# EAGLE design PCBMotores (EAGLE 7.6.0)
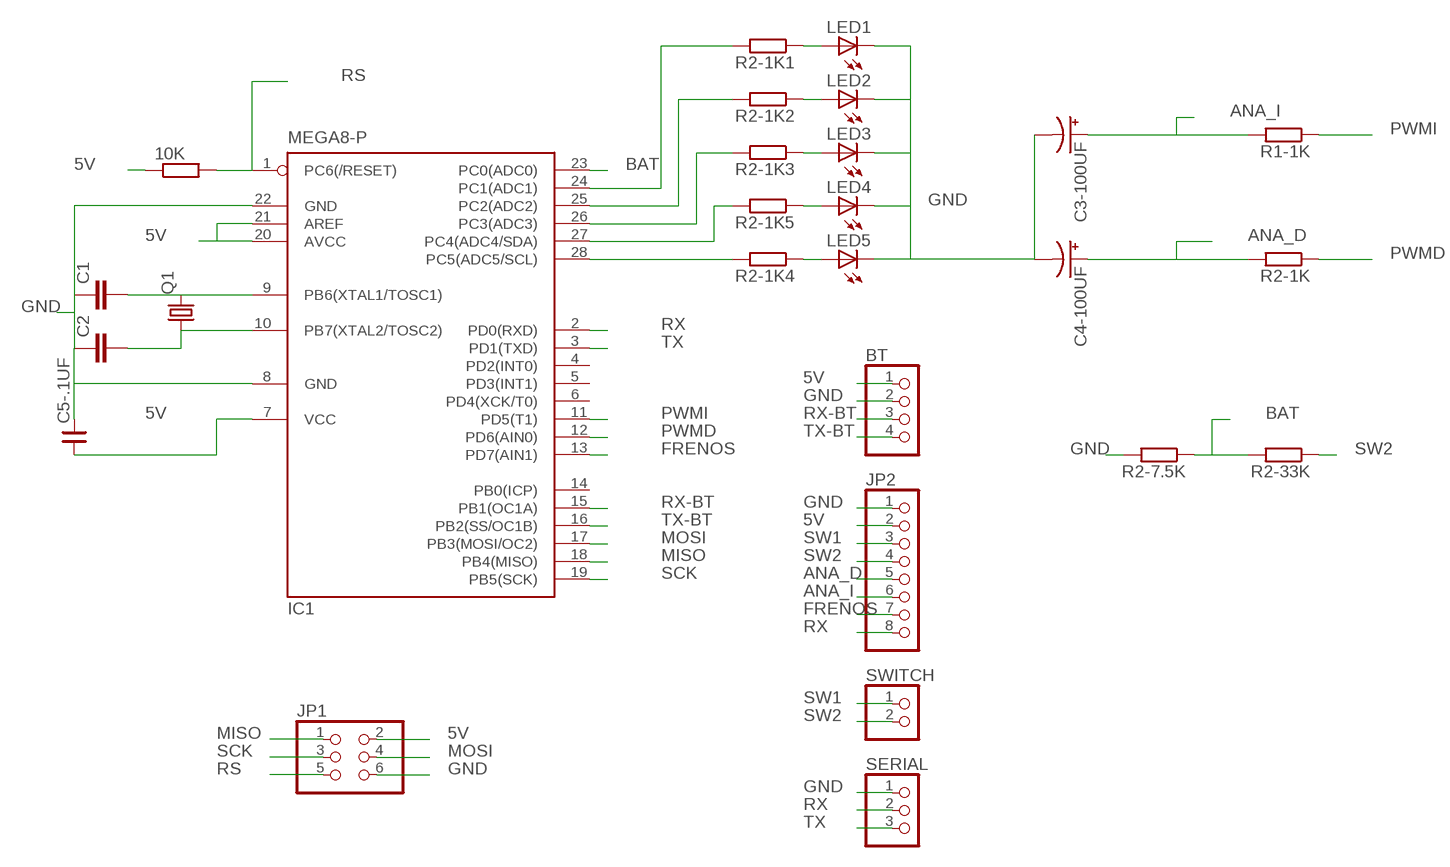
[diagram p0: schematic, sheet 1]

## Parts
10K  R-EU_0204/7  [0204/7]
BT  PINHD-1X4  [1X04]
C1  C2.5/5  [C2.5-5]
C2  C2.5/5  [C2.5-5]
C3-100UF  CPOL-USE2-4  [E2-4]
C4-100UF  CPOL-USE2-4  [E2-4]
C5-.1UF  CNP-C035-055X025  [C035-055X025]
IC1  MEGA8-P  [DIL28-3]
JP1  PINHD-2X3  [2X03]
JP2  PINHD-1X8  [1X08]
LED1  LED5MM  [LED5MM]
LED2  LED5MM  [LED5MM]
LED3  LED5MM  [LED5MM]
LED4  LED5MM  [LED5MM]
LED5  LED5MM  [LED5MM]
Q1  CRYSTALHC49S  [HC49/S]
R1-1K  R-EU_0207/10  [0207/10]
R2-1K  R-EU_0207/10  [0207/10]
R2-1K1  R-EU_0207/10  [0207/10]
R2-1K2  R-EU_0207/10  [0207/10]
R2-1K3  R-EU_0207/10  [0207/10]
R2-1K4  R-EU_0207/10  [0207/10]
R2-1K5  R-EU_0207/10  [0207/10]
R2-7.5K  R-EU_0207/10  [0207/10]
R2-33K  R-EU_0207/10  [0207/10]
SERIAL  PINHD-1X3  [1X03]
SWITCH  PINHD-1X2  [1X02]

## Nets
5V: 10K.1 BT.1 C5-.1UF.1 IC1.7(VCC) IC1.20(AVCC) IC1.21(AREF) JP1.2 JP2.2
ANA_D: C4-100UF.+ JP2.5 R2-1K.2
ANA_I: C3-100UF.+ JP2.6 R1-1K.2
BAT: IC1.23(PC0(ADC0)) R2-7.5K.1 R2-33K.2
FRENOS: IC1.13(PD7(AIN1)) JP2.7
GND: BT.2 C1.1 C2.1 C3-100UF.- C4-100UF.- C5-.1UF.2 IC1.8(GND) IC1.22(GND) JP1.6 JP2.1 LED1.K(C) LED2.K(C) LED3.K(C) LED4.K(C) LED5.K(C) R2-7.5K.2 SERIAL.1
MISO: IC1.18(PB4(MISO)) JP1.1
MOSI: IC1.17(PB3(MOSI/OC2)) JP1.4
N$3: IC1.28(PC5(ADC5/SCL)) R2-1K4.2
N$4: IC1.27(PC4(ADC4/SDA)) R2-1K5.2
N$5: IC1.26(PC3(ADC3)) R2-1K3.2
N$6: C2.2 IC1.10(PB7(XTAL2/TOSC2)) Q1.1
N$7: C1.2 IC1.9(PB6(XTAL1/TOSC1)) Q1.2
N$8: IC1.25(PC2(ADC2)) R2-1K2.2
N$9: IC1.24(PC1(ADC1)) R2-1K1.2
N$10: LED1.A R2-1K1.1
N$11: LED2.A R2-1K2.1
N$12: LED3.A R2-1K3.1
N$13: LED4.A R2-1K5.1
N$14: LED5.A R2-1K4.1
PWMD: IC1.12(PD6(AIN0)) R2-1K.1
PWMI: IC1.11(PD5(T1)) R1-1K.1
RS: 10K.2 IC1.1(PC6(/RESET)) JP1.5
RX: IC1.2(PD0(RXD)) JP2.8 SERIAL.2
RX-BT: BT.3 IC1.15(PB1(OC1A))
SCK: IC1.19(PB5(SCK)) JP1.3
SW1: JP2.3 SWITCH.1
SW2: JP2.4 R2-33K.1 SWITCH.2
TX: IC1.3(PD1(TXD)) SERIAL.3
TX-BT: BT.4 IC1.16(PB2(SS/OC1B))
Unconnected: IC1.4(PD2(INT0)) IC1.5(PD3(INT1)) IC1.6(PD4(XCK/T0)) IC1.14(PB0(ICP))

## Library data of the parts
10K R1-1K R2-1K R2-1K1-R2-1K5 R2-7.5K R2-33K = rcl:R-EU_: RESISTOR, European symbol
BT = pinhead:PINHD-1X4: PIN HEADER
C1 C2 = capacitor-wima:C: CAPACITOR naming: grid - package width
C3-100UF C4-100UF = rcl:CPOL-US: POLARIZED CAPACITOR, American symbol
C5-.1UF = cap-master:CNP-: NON-POLARIZED CAP
IC1 = atmel:MEGA8-P: MICROCONTROLLER 8 Kbytes FLASH, 1 kbytes SRAM, 512 bytes EEPROM, USART, 4-channel 10 bit ADC, 2-channel 8 bit ADC Pin compatible with Atmega48, ATMega88, ATMega168 Source: avr.lbr; OC_FARNELL: unknown; OC_NEWARK: unknown
JP1 = pinhead:PINHD-2X3: PIN HEADER
JP2 = pinhead:PINHD-1X8: PIN HEADER
LED1-LED5 = led:LED: LED OSRAM: - CHIPLED LG R971, LG N971, LY N971, LG Q971, LY Q971, LO R971, LY R971 LH N974, LH R974 LS Q976, LO Q976, LY Q976 LO Q996 - Hyper CHIPLED LW Q18S LB Q993, LB Q99A, LB R99A - SideLED LS A670, LO A670, LY A670, LG A670, LP A670 LB A673, LV A673, LT A673, LW A673 LH A674 LY A675 LS A676, LA A676, LO A676, LY A676, LW A676 LS A679, LY A679, LG A679 - Hyper Micro SIDELED® LS Y876, LA Y876, LO Y876, LY Y876 LT Y87S - SmartLED LW L88C, LW L88S LB L89C, LB L89S, LG L890 LS L89K, LO L89K, LY L89K LS L896, LA L896, LO L896, LY L896 - TOPLED LS T670, LO T670, LY T670, LG T670, LP T670 LSG T670, LSP T670, LSY T670, LOP T670, LYG T670 LG T671, LOG T671, LSG T671 LB T673, LV T673, LT T673, LW T673 LH T674 LS T676, LA T676, LO T676, LY T676, LB T676, LH T676, LSB T676, LW T676 LB T67C, LV T67C, LT T67C, LS T67K, LO T67K, LY T67K, LW E67C LS E67B, LA E67B, LO E67B, LY E67B, LB E67C, LV E67C, LT E67C LW T67C LS T679, LY T679, LG T679 LS T770, LO T770, LY T770, LG T770, LP T770 LB T773, LV T773, LT T773, LW T773 LH T774 LS E675, LA E675, LY E675, LS T675 LS T776, LA T776, LO T776, LY T776, LB T776 LHGB T686 LT T68C, LB T68C - Hyper Mini TOPLED® LB M676 - Mini TOPLED Santana® LG M470 LS M47K, LO M47K, LY M47K Source: http://www.osram.convergy.de LUXEON: - LUMILED® LXK2-PW12-R00, LXK2-PW12-S00, LXK2-PW14-U00, LXK2-PW14-V00 LXK2-PM12-R00, LXK2-PM12-S00, LXK2-PM14-U00 LXK2-PE12-Q00, LXK2-PE12-R00, LXK2-PE12-S00, LXK2-PE14-T00, LXK2-PE14-U00 LXK2-PB12-K00, LXK2-PB12-L00, LXK2-PB12-M00, LXK2-PB14-N00, LXK2-PB14-P00, LXK2-PB14-Q00 LXK2-PR12-L00, LXK2-PR12-M00, LXK2-PR14-Q00, LXK2-PR14-R00 LXK2-PD12-Q00, LXK2-PD12-R00, LXK2-PD12-S00 LXK2-PH12-R00, LXK2-PH12-S00 LXK2-PL12-P00, LXK2-PL12-Q00, LXK2-PL12-R00 Source: www.luxeon.com KINGBRIGHT: KA-3528ASYC Source: www.kingbright.com
Q1 = crystal:CRYSTAL: CRYSTAL; OC_FARNELL: 1667008; OC_NEWARK: unknown
SERIAL = pinhead:PINHD-1X3: PIN HEADER
SWITCH = pinhead:PINHD-1X2: PIN HEADER

## Board
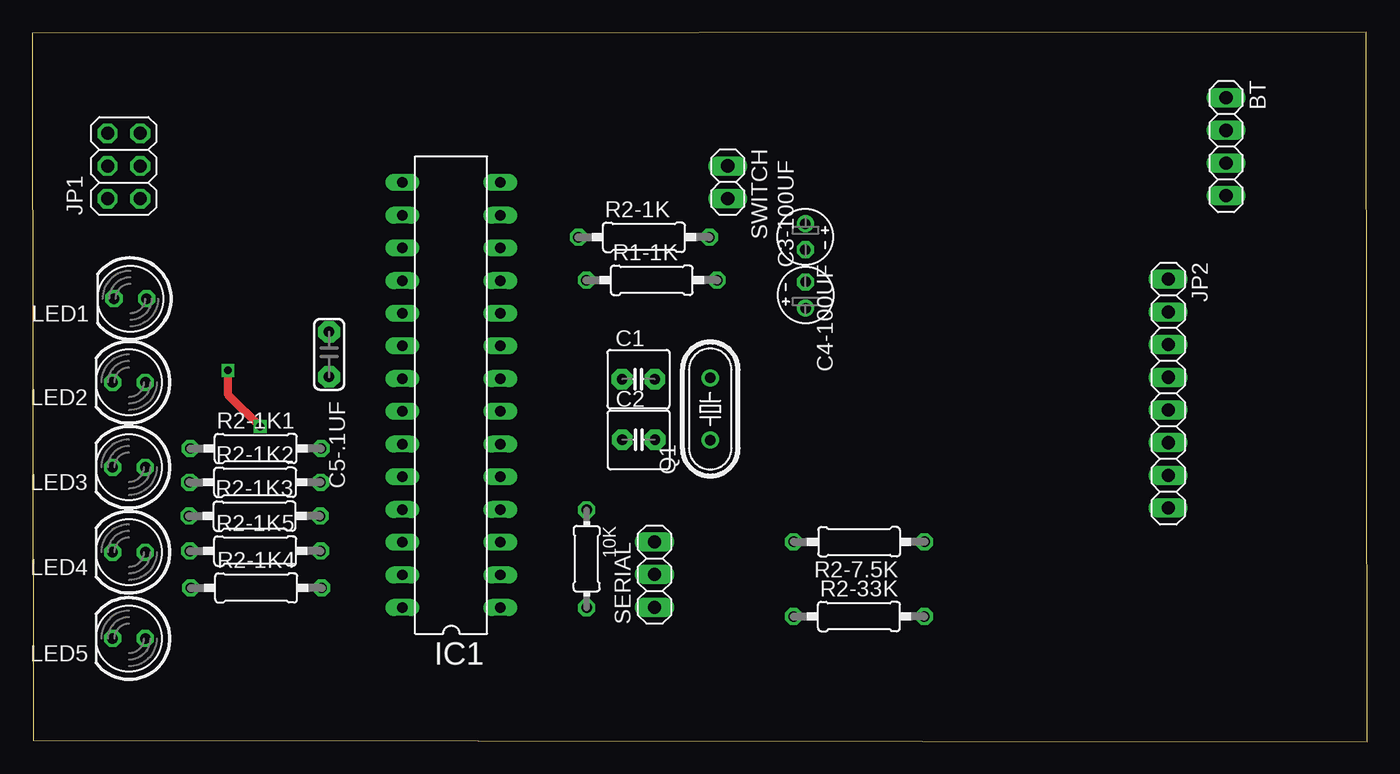
[diagram p1: board, top side]
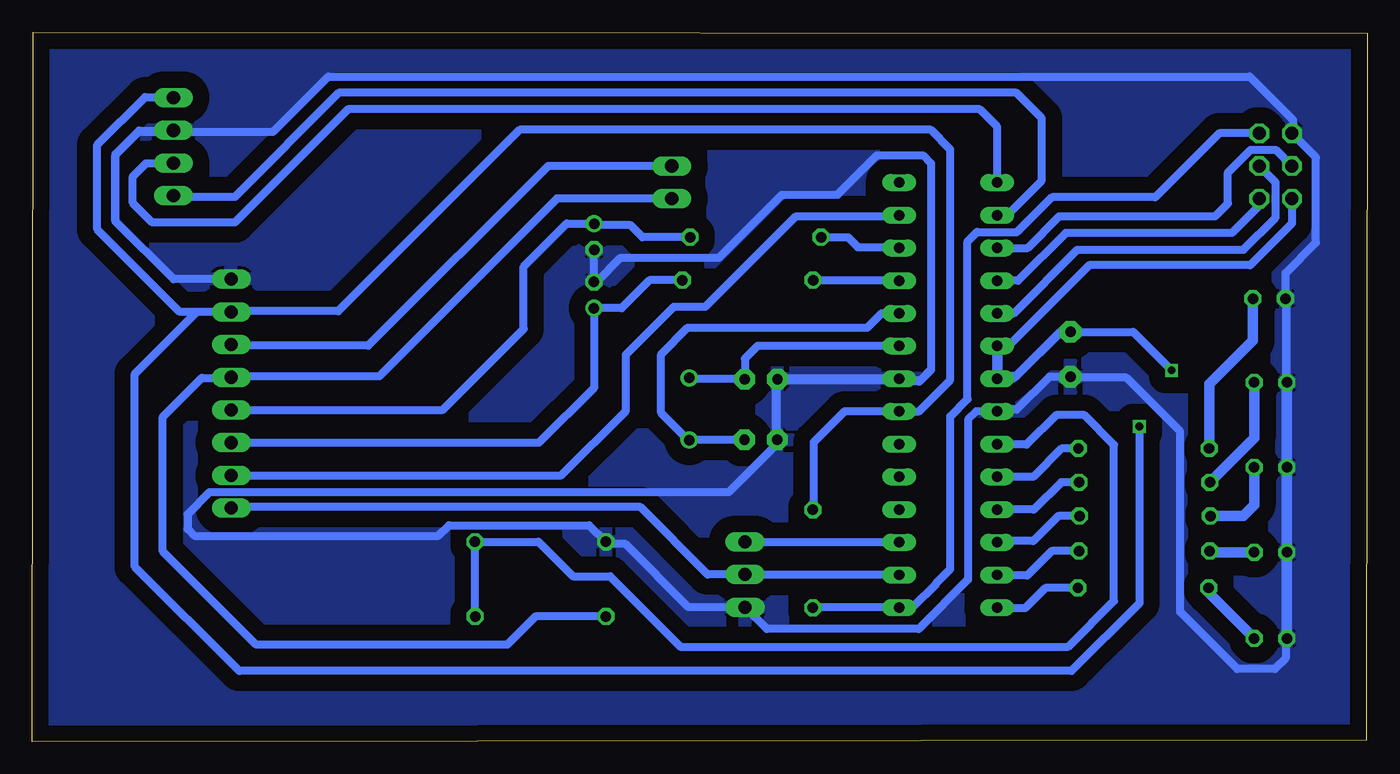
[diagram p2: board, bottom side, seen from below]

Size 103.69 x 55.11 mm. Coordinates in mm from the lower left corner, seen from the top.
Outline: 0.08,0.1 103.69,0 103.61,55.11 0,55.01 0.08,0.1
Copper layers (1*16): Top 0.035mm / dielectric 1.5mm / Bottom 0.035mm
Design rules "default": minimum track width 10mil, minimum drill 24mil, track to track 8mil, track to pad 8mil, pad to pad 8mil, via to via 8mil, smd to smd 8mil, copper to edge 40mil, drill to drill 8mil, minimum pad ring 10mil, minimum via ring 8mil, stop-mask expansion 4mil, vias tented up to drill 0mil, thermal gap 10mil

### Footprints (pad centres in the part's own frame; a part is rotated, then mirrored left to right if it is on the bottom)
0204/7 = drill 0.813 octagon: 1 -3.81,0; 2 3.81,0
1X04 = drill 1.016 long: 1 -3.81,0; 2 -1.27,0; 3 1.27,0; 4 3.81,0
C2.5-5 = drill 0.813 pad 1.6 octagon: 1 -1.27,0; 2 1.27,0
E2-4 = drill 0.813 pad 1.27: + -1.016,0 | drill 0.813 pad 1.27 octagon: - 1.016,0
C035-055X025 = drill 0.813 pad 1.676 octagon: 1 -1.587,0; 2 1.905,0
DIL28-3 = drill 0.813 long: 1 -16.51,-3.81; 2 -13.97,-3.81; 3 -11.43,-3.81; 4 -8.89,-3.81; 5 -6.35,-3.81; 6 -3.81,-3.81; 7 -1.27,-3.81; 8 1.27,-3.81; 9 3.81,-3.81; 10 6.35,-3.81; 11 8.89,-3.81; 12 11.43,-3.81; 13 13.97,-3.81; 14 16.51,-3.81; 15 16.51,3.81; 16 13.97,3.81; 17 11.43,3.81; 18 8.89,3.81; 19 6.35,3.81; 20 3.81,3.81; 21 1.27,3.81; 22 -1.27,3.81; 23 -3.81,3.81; 24 -6.35,3.81; 25 -8.89,3.81; 26 -11.43,3.81; 27 -13.97,3.81; 28 -16.51,3.81
2X03 = drill 1.016 octagon: 1 -2.54,-1.27; 2 -2.54,1.27; 3 0,-1.27; 4 0,1.27; 5 2.54,-1.27; 6 2.54,1.27
1X08 = drill 1.016 long: 1 -8.89,0; 2 -6.35,0; 3 -3.81,0; 4 -1.27,0; 5 1.27,0; 6 3.81,0; 7 6.35,0; 8 8.89,0
LED5MM = drill 0.813 octagon: A -1.27,0; K 1.27,0
HC49/S = drill 0.813: 1 -2.413,0; 2 2.413,0
0207/10 = drill 0.813 octagon: 1 -5.08,0; 2 5.08,0
1X03 = drill 1.016 long: 1 -2.54,0; 2 0,0; 3 2.54,0
1X02 = drill 1.016 long: 1 -1.27,0; 2 1.27,0

### Placement (x,y rotation side)
10K  43.06,14.2 270 top
BT  92.72,46.21 270 top
C1  47.08,28.15 0 top
C2  47.1,23.44 0 top
C3-100UF  60.06,34.69 90 top
C4-100UF  60.05,39.22 270 top
C5-.1UF  23.06,30.24 270 top
IC1  32.55,26.92 90 top
JP1  7.12,44.71 90 top
JP2  88.23,27.03 270 top
LED1  7.62,34.41 180 top
LED2  7.52,27.91 180 top
LED3  7.52,21.31 180 top
LED4  7.52,14.71 180 top
LED5  7.52,8.01 180 top
Q1  52.66,25.84 90 top
R1-1K  48.12,35.84 0 top
R2-1K  47.51,39.18 0 top
R2-1K1  17.36,22.77 0 top
R2-1K2  17.31,20.15 0 top
R2-1K3  17.27,17.52 0 top
R2-1K4  17.4,11.94 0 top
R2-1K5  17.32,14.81 0 top
R2-7.5K  64.22,15.52 180 top
R2-33K  64.21,9.72 0 top
SERIAL  48.33,12.98 90 top
SWITCH  54.02,43.45 270 top

### Tracks (layer width: path | path; a pad name or v marks a point on that pad's centre or on a via)
5V  (via drill 0.6)
  Top 0.61: v15.2,28.84 15.2,26.98 v17.7,24.48
  Bottom 0.61: JP1.2 5.85,40.25 9.09,37.01 21.59,37.01 27.88,30.72 IC1.20 | C5-.1UF.1 23.81,31.83 27.25,28.39 28.54,28.39 IC1.21 27.49,28.19 23.86,31.82 18.18,31.82 v15.2,28.84 | 10K.1 43,18.07 43,23.24 40.59,25.65 IC1.7 34.82,25.65 32.38,28.09 32.38,46 33.91,47.53 65.82,47.53 79.92,33.43 88.18,33.43 JP2.2 90.91,33.38 | 90.91,33.38 92.23,33.38 98.63,39.78 98.63,46.36 94.92,50.07 92.77,50.07 BT.1 | v17.7,24.48 17.7,10.75 22.97,5.48 87.61,5.48 95.72,13.59 95.72,28.57 90.91,33.38
  Bottom 0.813: IC1.20 IC1.21
ANA_D
  Bottom 0.61: JP2.5 71.81,25.76 65.52,32.05 65.52,36.9 62.18,40.24 60.6,40.24 | 60.6,40.24 C4-100UF.+ | R2-1K.2 56.29,39.18 57.22,40.11 60.47,40.11 60.6,40.24
ANA_I
  Bottom 0.61: R1-1K.2 55.73,35.84 57.91,33.66 60.05,33.66 C3-100UF.+ 60.03,33.64 60.03,27.52 64.33,23.22 JP2.6
BAT
  Bottom 0.61: R2-33K.2 R2-7.5K.1 64.38,15.52 61.7,12.84 58.81,12.84 53.34,7.37 23.23,7.37 19.67,10.93 19.67,23.06 21.98,25.37 24.16,25.37 26.46,23.07 28.7,23.07 IC1.23
FRENOS
  Bottom 0.61: JP2.7 62.61,20.68 57.59,25.7 57.59,30.05 53.86,33.78 51.4,33.78 44.36,40.82 36.43,40.82 IC1.13
GND
  Bottom 0.61: LED2.K 6.25,34.31 LED1.K | C5-.1UF.2 24.69,28.34 27.25,25.78 28.61,25.78 IC1.22 30.37,25.65 31,25.02 31,12.59 34.84,8.75 46.64,8.75 SERIAL.1 52.71,10.44 57.62,15.35 58.97,15.35 R2-7.5K.2 60.43,16.81 71.33,16.81 72.15,15.99 91.1,15.99 91.63,16.52 91.63,17.66 89.93,19.36 49.6,19.36 45.96,23 45.96,28.2 45.8,28.04 34.72,28.04 33.88,28.88 33.88,28.89 | C5-.1UF.2 23.06,28.42 | C2.1 45.83,28.13 C1.1 45.77,28.19 IC1.8 36.14,27.97 34.8,27.97 33.88,28.89 | C4-100UF.- C3-100UF.- 59.87,35.71 57.99,37.59 50.36,37.59 45.46,42.49 41.15,42.49 38.09,45.55 34.52,45.55 33.88,44.91 33.88,28.89 | BT.2 92.74,47.46 95.39,47.46 97.21,45.64 97.21,40.41 92.72,35.92 JP2.1 92.71,35.92 97.24,40.45 97.24,45.54 95.4,47.38 84.98,47.38 80.7,51.66 9.14,51.66 5.78,48.3 5.78,47.32 JP1.6 4,45.4 4,38.75 6.35,36.4 LED1.K | LED1.K 6.35,6.47 7.18,5.64 10.1,5.64 14.53,10.07 14.53,24.08 18.72,28.27 22.99,28.27 C5-.1UF.2
  Bottom 0.813: LED5.K LED4.K LED3.K LED2.K
  pour Bottom (isolate 1.27): 102.31,53.71 102.52,1.28 1.51,1.28 1.3,53.71
MISO
  Bottom 0.61: JP1.1 8.39,41.64 10.52,39.51 23.42,39.51 27.12,35.81 IC1.18
MOSI
  Bottom 0.61: IC1.17 26.38,38.35 23.92,40.81 11.82,40.81 10.82,41.81 10.82,44.21 9.08,45.95 9.06,45.95 9.03,45.98 7.12,45.98 JP1.4
N$3
  Bottom 0.61: R2-1K4.2 25,11.94 26.58,10.36 28.69,10.36 IC1.28
N$4
  Bottom 0.61: R2-1K5.2 24.51,14.81 26.41,12.91 28.7,12.91 IC1.27
N$5
  Bottom 0.61: R2-1K3.2 24.01,17.52 25.95,15.58 28.65,15.58 IC1.26
N$6
  Bottom 0.61: C2.2 52.65,23.44 Q1.1 52.75,23.43 54.85,25.53 54.85,30.08 52.78,32.15 38.84,32.15 37.7,33.29 36.38,33.29 IC1.10
N$7
  Bottom 0.61: IC1.9 47.35,30.73 48.34,29.74 C1.2 52.56,28.15 Q1.2
N$8
  Bottom 0.61: R2-1K2.2 23.77,20.15 25.9,18.02 IC1.25
N$9
  Bottom 0.61: R2-1K1.2 23.75,22.77 25.95,20.57 IC1.24
N$10
  Bottom 0.813: LED1.A 8.89,31.15 12.26,27.78 12.26,22.79 R2-1K1.1
N$11
  Bottom 0.813: LED2.A 8.79,23.59 R2-1K2.1
N$12
  Bottom 0.813: LED3.A 8.79,18.38 9.63,17.54 12.17,17.54 R2-1K3.1
N$13
  Bottom 0.813: LED4.A 12.14,14.71 R2-1K5.1
N$14
  Bottom 0.813: R2-1K4.1 12.32,11.54 LED5.A
PWMD
  Bottom 0.61: R2-1K.1 40.33,39.18 39.56,38.41 36.42,38.41 IC1.12
PWMI
  Bottom 0.61: IC1.11 43.01,35.81 R1-1K.1
RS
  Bottom 0.61: 10K.2 43.04,10.41 IC1.1 35.33,10.41 33.47,12.27 33.47,12.32 32.38,13.41 32.38,25.27 31.05,26.6 31.05,38.86 30.32,39.59 27.19,39.59 27.06,39.72 27.05,39.72 24.48,42.29 16.47,42.29 11.51,47.25 JP1.5
RX
  Bottom 0.61: IC1.2 48.3,12.95 SERIAL.2 51.23,12.98 56.46,18.21 88.16,18.21 JP2.8
RX-BT
  Bottom 0.61: IC1.15 28.74,47.76 30.1,49.12 79.17,49.12 87.96,40.33 94.36,40.33 95.87,41.84 95.87,43.89 94.84,44.92 92.74,44.92 BT.3
SCK
  Bottom 0.61: IC1.19 27.46,33.27 22.52,38.21 9.62,38.21 7.12,40.71 7.12,43.44 JP1.3
SW1
  Bottom 0.61: SWITCH.1 63.62,44.72 77.59,30.75 88.14,30.75 JP2.3
SW2
  Bottom 0.61: SWITCH.2 62.93,42.18 76.73,28.38 88.12,28.38 88.59,27.91 88.59,27.94 JP2.4 88.28,28.25 90.51,28.25 93.54,25.22 93.54,14.79 86.28,7.53 66.79,7.53 64.6,9.72 R2-33K.1
TX
  Bottom 0.61: IC1.3 48.3,15.49 SERIAL.3
TX-BT
  Bottom 0.61: IC1.16 27.97,40.89 25.28,43.58 25.28,48.42 27.25,50.39 79.88,50.39 87.96,42.31 92.63,42.31 BT.4